# EAGLE design IR Interface Board (EAGLE 7.6.0)

## Sheet 1 of 3
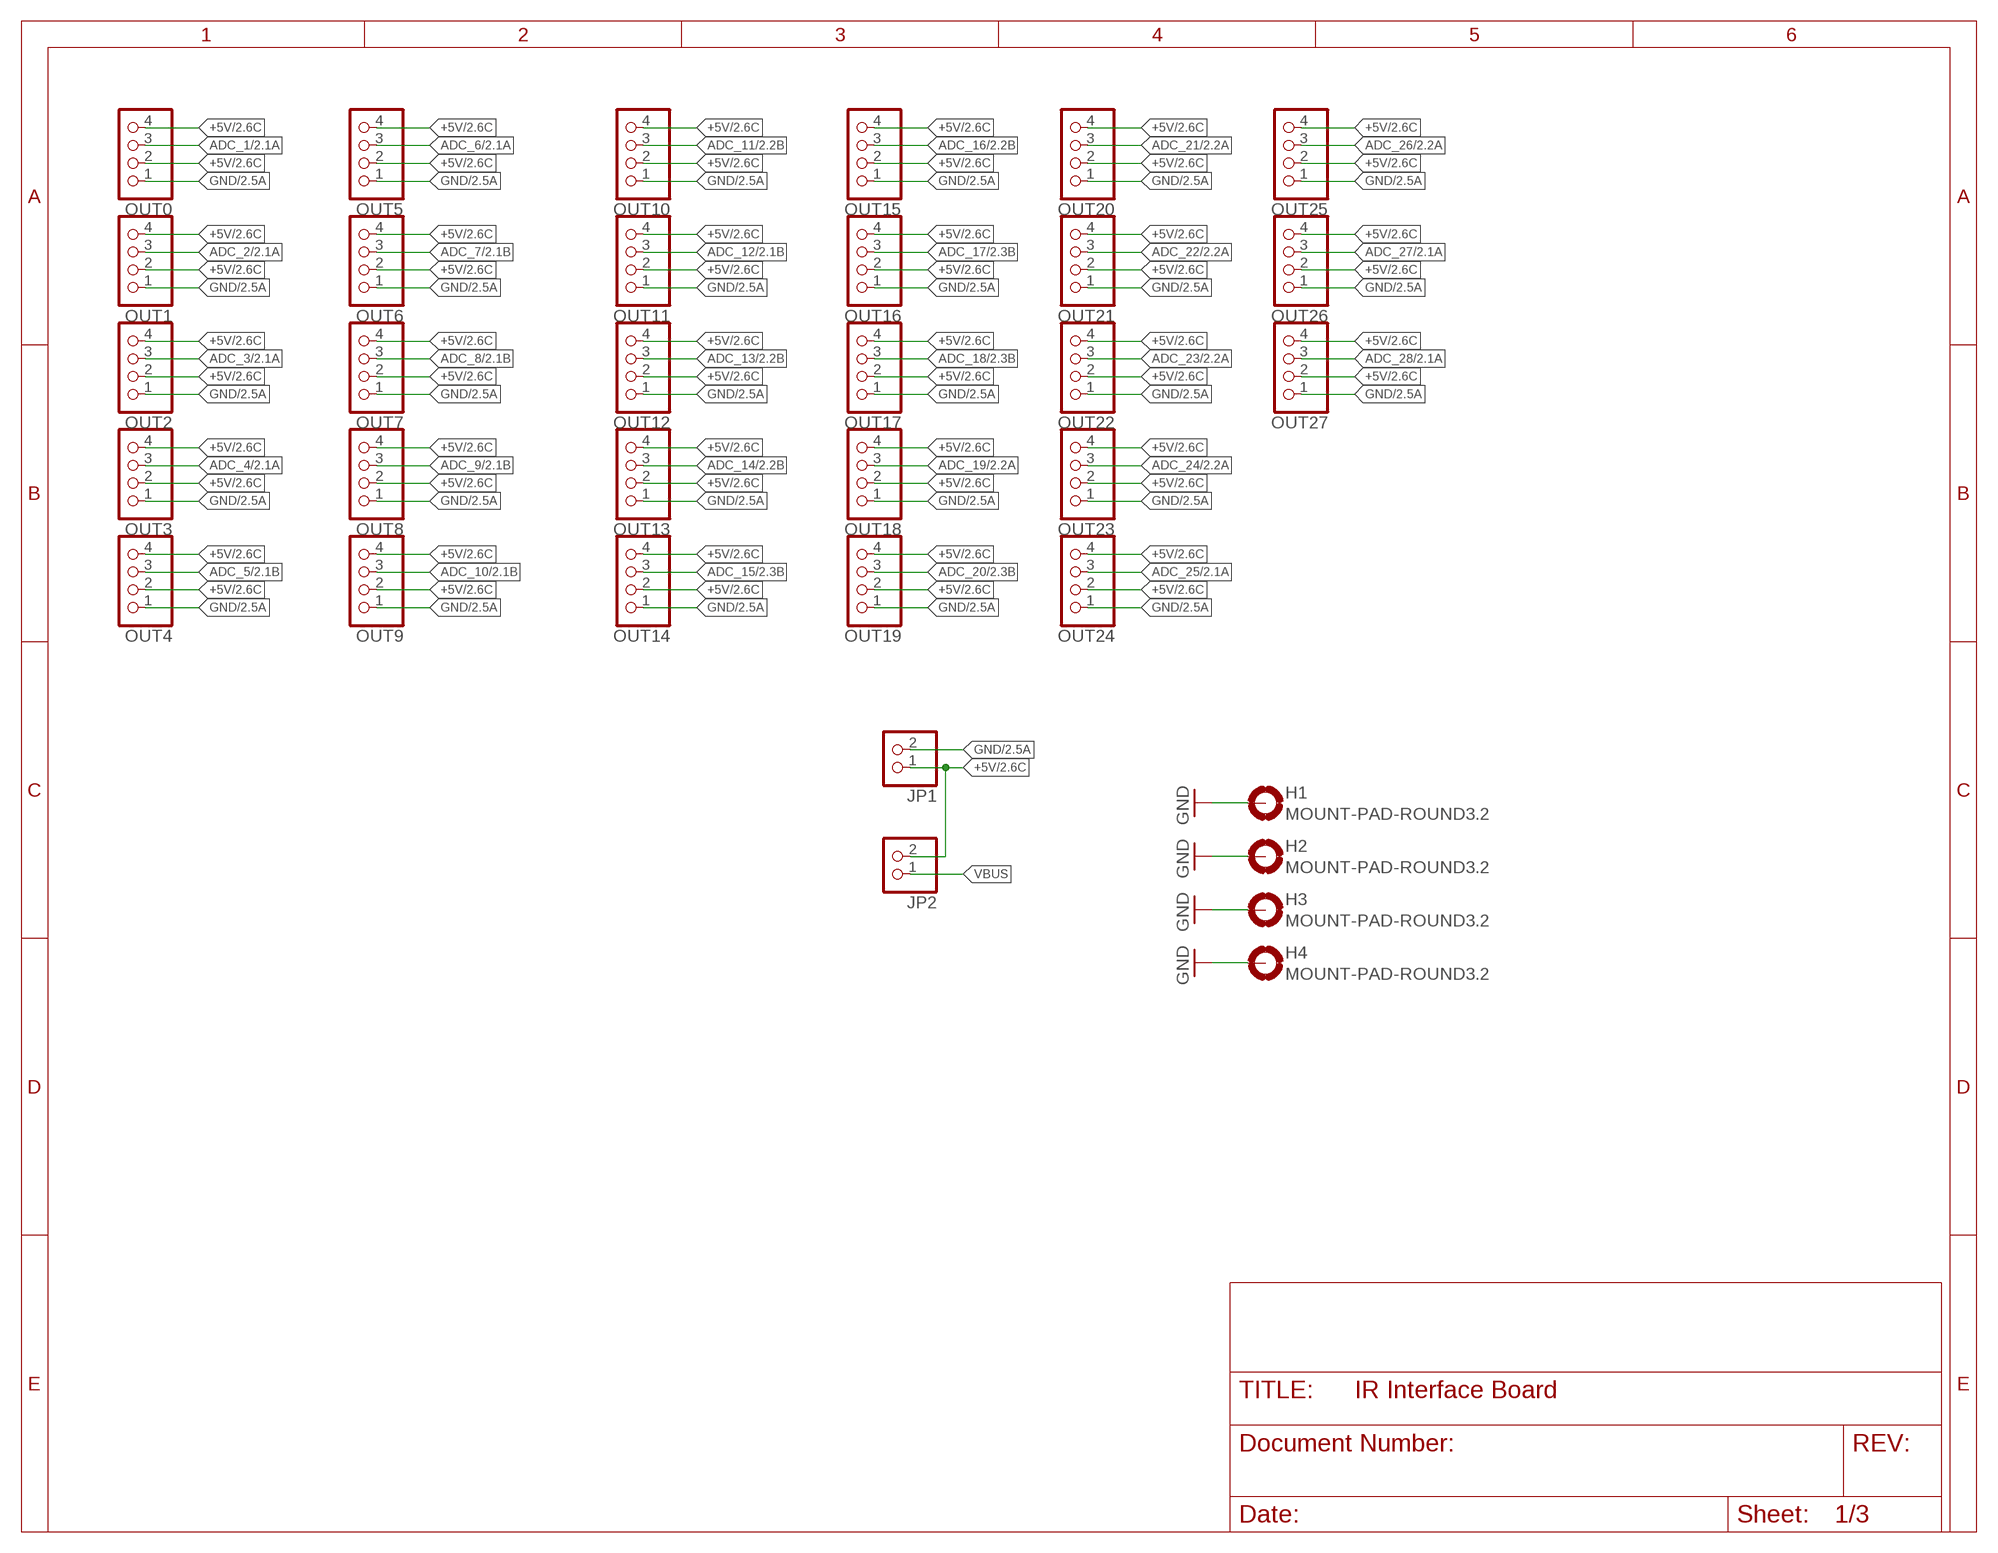
[diagram p0: schematic, sheet 1]

### Parts
H1  MOUNT-PAD-ROUND3.2  [3,2-PAD]
H2  MOUNT-PAD-ROUND3.2  [3,2-PAD]
H3  MOUNT-PAD-ROUND3.2  [3,2-PAD]
H4  MOUNT-PAD-ROUND3.2  [3,2-PAD]
JP1  PINHD-1X2  [1X02]
JP2  PINHD-1X2  [1X02]
OUT0  PINHD-1X4  [1X04]
OUT1  PINHD-1X4  [1X04]
OUT2  PINHD-1X4  [1X04]
OUT3  PINHD-1X4  [1X04]
OUT4  PINHD-1X4  [1X04]
OUT5  PINHD-1X4  [1X04]
OUT6  PINHD-1X4  [1X04]
OUT7  PINHD-1X4  [1X04]
OUT8  PINHD-1X4  [1X04]
OUT9  PINHD-1X4  [1X04]
OUT10  PINHD-1X4  [1X04]
OUT11  PINHD-1X4  [1X04]
OUT12  PINHD-1X4  [1X04]
OUT13  PINHD-1X4  [1X04]
OUT14  PINHD-1X4  [1X04]
OUT15  PINHD-1X4  [1X04]
OUT16  PINHD-1X4  [1X04]
OUT17  PINHD-1X4  [1X04]
OUT18  PINHD-1X4  [1X04]
OUT19  PINHD-1X4  [1X04]
OUT20  PINHD-1X4  [1X04]
OUT21  PINHD-1X4  [1X04]
OUT22  PINHD-1X4  [1X04]
OUT23  PINHD-1X4  [1X04]
OUT24  PINHD-1X4  [1X04]
OUT25  PINHD-1X4  [1X04]
OUT26  PINHD-1X4  [1X04]
OUT27  PINHD-1X4  [1X04]

### Nets
+5V: JP1.1 JP2.2 OUT0.2 OUT0.4 OUT1.2 OUT1.4 OUT2.2 OUT2.4 OUT3.2 OUT3.4 OUT4.2 OUT4.4 OUT5.2 OUT5.4 OUT6.2 OUT6.4 OUT7.2 OUT7.4 OUT8.2 OUT8.4 OUT9.2 OUT9.4 OUT10.2 OUT10.4 OUT11.2 OUT11.4 OUT12.2 OUT12.4 OUT13.2 OUT13.4 OUT14.2 OUT14.4 OUT15.2 OUT15.4 OUT16.2 OUT16.4 OUT17.2 OUT17.4 OUT18.2 OUT18.4 OUT19.2 OUT19.4 OUT20.2 OUT20.4 OUT21.2 OUT21.4 OUT22.2 OUT22.4 OUT23.2 OUT23.4 OUT24.2 OUT24.4 OUT25.2 OUT25.4 OUT26.2 OUT26.4 OUT27.2 OUT27.4 ; also sheet 2
ADC_1: OUT0.3 ; also sheet 2
ADC_2: OUT1.3 ; also sheet 2
ADC_3: OUT2.3 ; also sheet 2
ADC_4: OUT3.3 ; also sheet 2
ADC_5: OUT4.3 ; also sheet 2
ADC_6: OUT5.3 ; also sheet 2
ADC_7: OUT6.3 ; also sheet 2
ADC_8: OUT7.3 ; also sheet 2
ADC_9: OUT8.3 ; also sheet 2
ADC_10: OUT9.3 ; also sheet 2
ADC_11: OUT10.3 ; also sheet 2
ADC_12: OUT11.3 ; also sheet 2
ADC_13: OUT12.3 ; also sheet 2
ADC_14: OUT13.3 ; also sheet 2
ADC_15: OUT14.3 ; also sheet 2
ADC_16: OUT15.3 ; also sheet 2
ADC_17: OUT16.3 ; also sheet 2
ADC_18: OUT17.3 ; also sheet 2
ADC_19: OUT18.3 ; also sheet 2
ADC_20: OUT19.3 ; also sheet 2
ADC_21: OUT20.3 ; also sheet 2
ADC_22: OUT21.3 ; also sheet 2
ADC_23: OUT22.3 ; also sheet 2
ADC_24: OUT23.3 ; also sheet 2
ADC_25: OUT24.3 ; also sheet 2
ADC_26: OUT25.3 ; also sheet 2
ADC_27: OUT26.3 ; also sheet 2
ADC_28: OUT27.3 ; also sheet 2
GND: H1.B3,2(MOUNT) H2.B3,2(MOUNT) H3.B3,2(MOUNT) H4.B3,2(MOUNT) JP1.2 OUT0.1 OUT1.1 OUT2.1 OUT3.1 OUT4.1 OUT5.1 OUT6.1 OUT7.1 OUT8.1 OUT9.1 OUT10.1 OUT11.1 OUT12.1 OUT13.1 OUT14.1 OUT15.1 OUT16.1 OUT17.1 OUT18.1 OUT19.1 OUT20.1 OUT21.1 OUT22.1 OUT23.1 OUT24.1 OUT25.1 OUT26.1 OUT27.1 ; also sheet 2
VBUS: JP2.1 ; also sheet 2

## Sheet 2 of 3
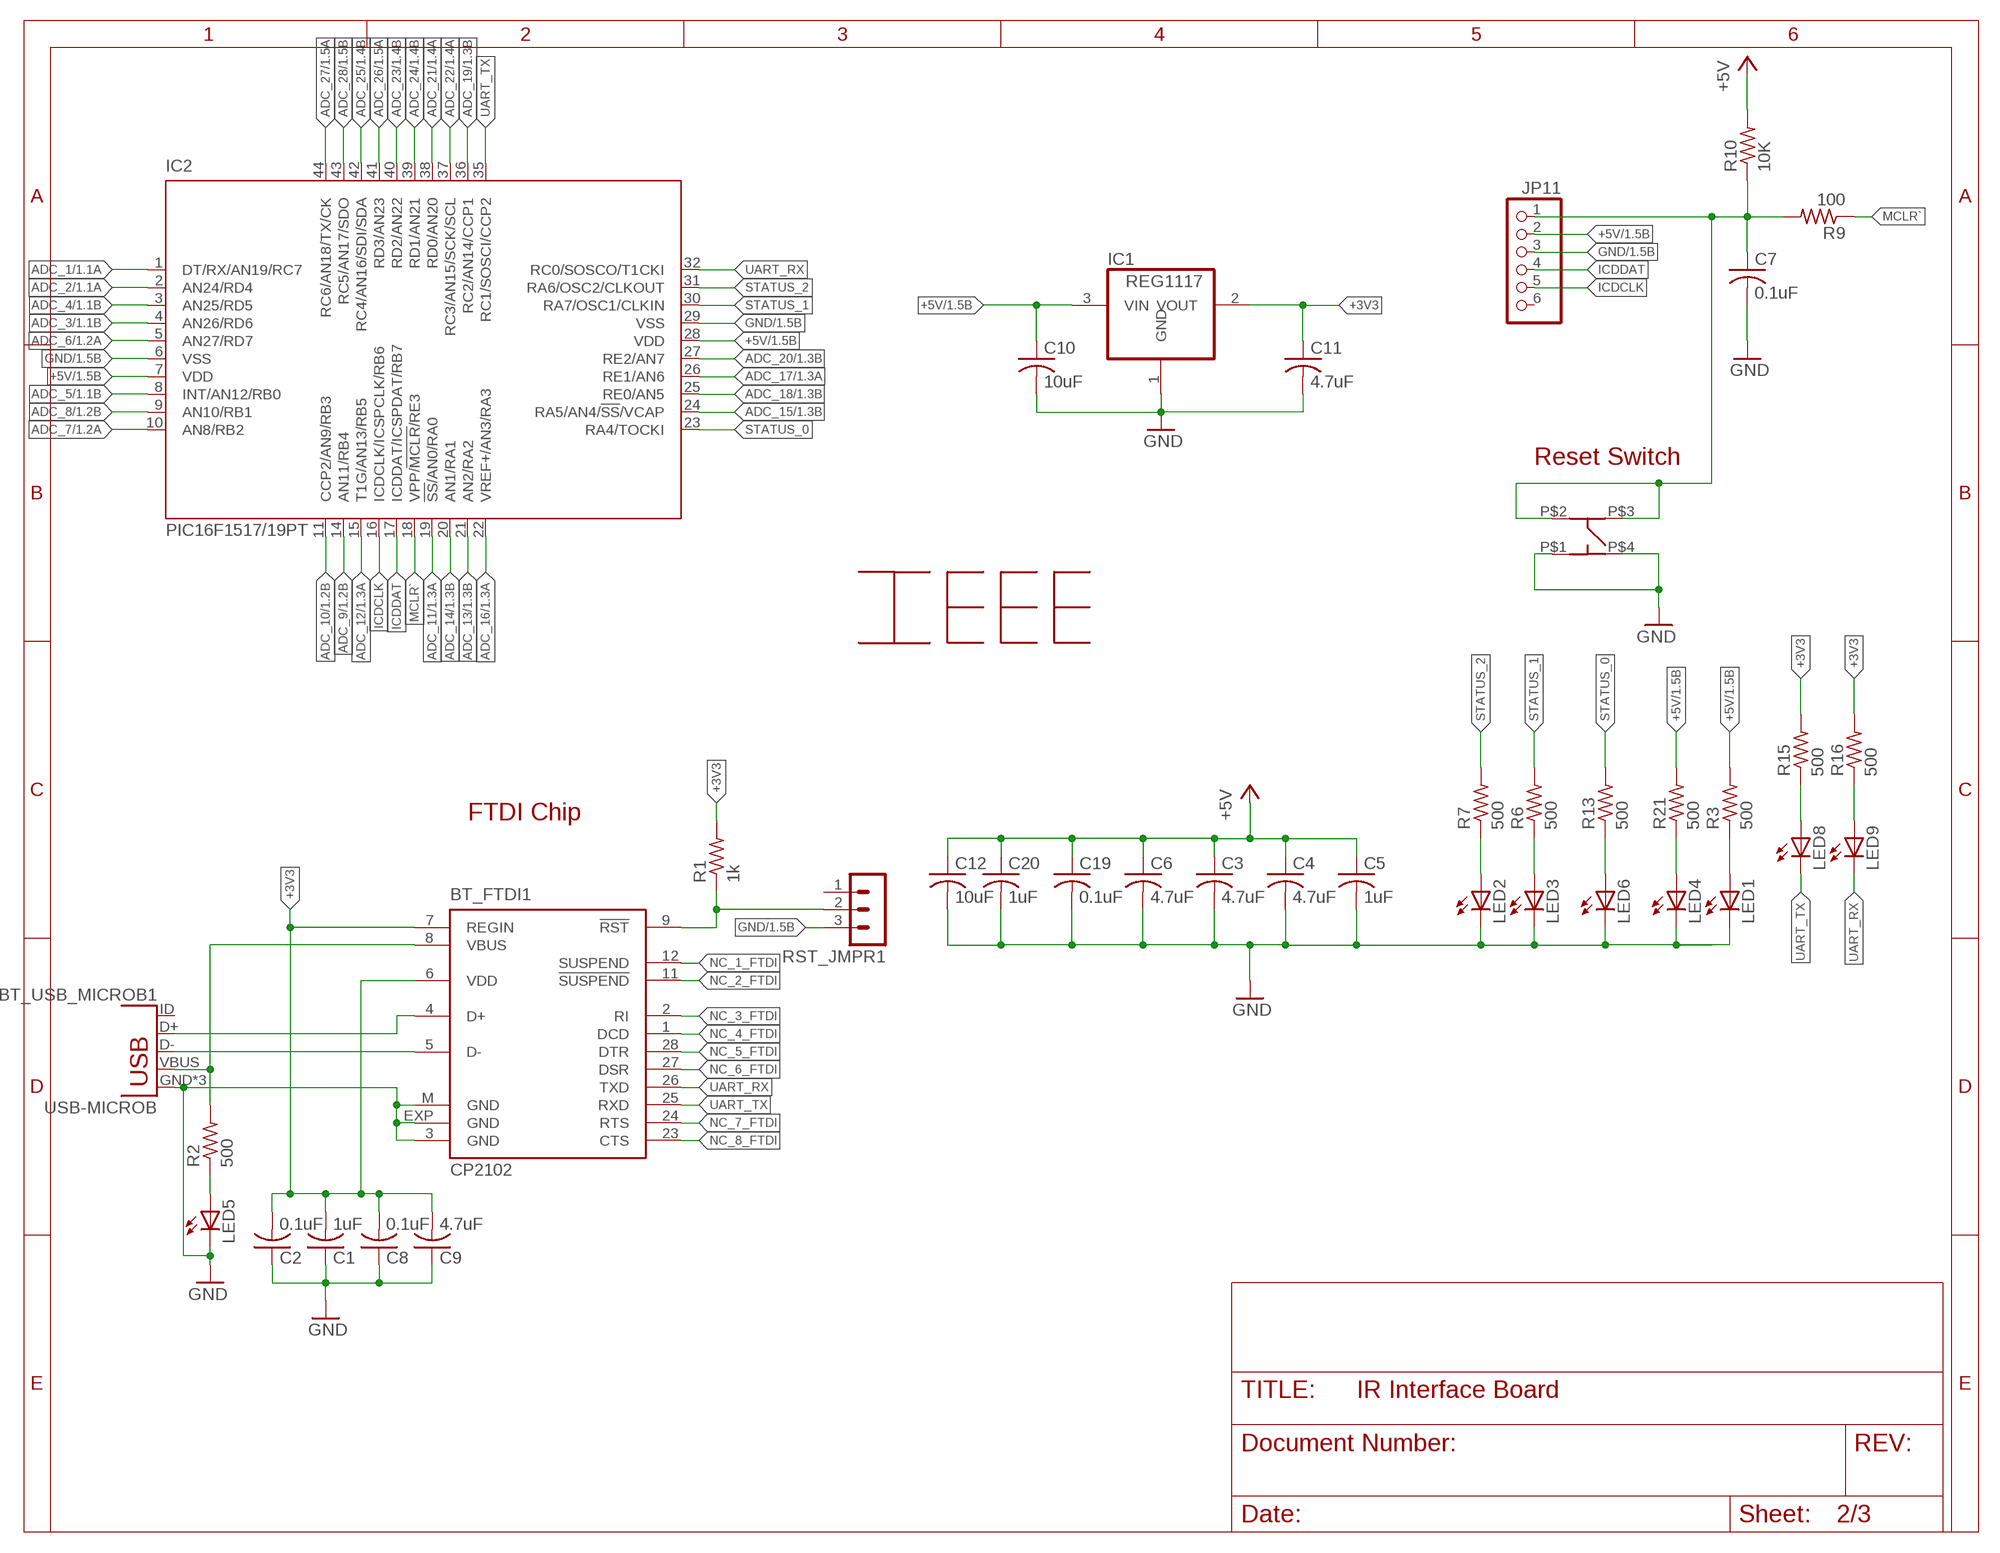
[diagram p1: schematic, sheet 2]

### Parts
BT_FTDI1  CP2102  [MLP28]
BT_USB_MICROB1  USB-MICROB  [USB-MICROB]
C1  1uF  C-USC0805  [C0805]
C2  0.1uF  C-USC0805  [C0805]
C3  4.7uF  C-USC0805  [C0805]
C4  4.7uF  C-USC0805  [C0805]
C5  1uF  C-USC0805  [C0805]
C6  4.7uF  C-USC0805  [C0805]
C7  0.1uF  C-USC0805  [C0805]
C8  0.1uF  C-USC0805  [C0805]
C9  4.7uF  C-USC0805  [C0805]
C10  10uF  C-USC0805  [C0805]
C11  4.7uF  C-USC0805  [C0805]
C12  10uF  C-USC0805  [C0805]
C19  0.1uF  C-USC0805  [C0805]
C20  1uF  C-USC0805  [C0805]
IC1  REG1117  [SOT223]
IC2  PIC16F1517/19PT  [TQFP44]
JP11  PINHD-1X6/90  [1X06/90]
LED1  LEDSML0603  [SML0603]
LED2  LEDSML0603  [SML0603]
LED3  LEDSML0603  [SML0603]
LED4  LEDSML0603  [SML0603]
LED5  LEDSML0603  [SML0603]
LED6  LEDSML0603  [SML0603]
LED8  LEDSML0603  [SML0603]
LED9  LEDSML0603  [SML0603]
R1  1k  R-US_R0805  [R0805]
R2  500  R-US_R0805  [R0805]
R3  500  R-US_R0805  [R0805]
R6  500  R-US_R0805  [R0805]
R7  500  R-US_R0805  [R0805]
R9  100  R-US_R0805  [R0805]
R10  10K  R-US_R0805  [R0805]
R13  500  R-US_R0805  [R0805]
R15  500  R-US_R0805  [R0805]
R16  500  R-US_R0805  [R0805]
R21  500  R-US_R0805  [R0805]
RST_JMPR1  MA03-1  [MA03-1]
TOUCH_RESET  RESET  MC32882_SW  [MC32882_FINAL]
U$1  LOGO  [IEEE-LOGO]

### Nets
+3V3: BT_FTDI1.6(VDD) BT_FTDI1.7(REGIN) C1.2 C2.2 C8.2 C9.2 C11.1 IC1.2(VOUT) R1.2 R15.2 R16.2
+5V: C3.1 C4.1 C5.1 C6.1 C10.1 C12.1 C19.1 C20.1 IC1.3(VIN) IC2.7(VDD) IC2.28(VDD) JP11.2 R3.2 R10.2 R21.2 ; also sheet 1
ADC_1: IC2.1(DT/RX/AN19/RC7) ; also sheet 1
ADC_2: IC2.2(AN24/RD4) ; also sheet 1
ADC_3: IC2.4(AN26/RD6) ; also sheet 1
ADC_4: IC2.3(AN25/RD5) ; also sheet 1
ADC_5: IC2.8(INT/AN12/RB0) ; also sheet 1
ADC_6: IC2.5(AN27/RD7) ; also sheet 1
ADC_7: IC2.10(AN8/RB2) ; also sheet 1
ADC_8: IC2.9(AN10/RB1) ; also sheet 1
ADC_9: IC2.14(AN11/RB4) ; also sheet 1
ADC_10: IC2.11(CCP2/AN9/RB3) ; also sheet 1
ADC_11: IC2.19(!SS!/AN0/RA0) ; also sheet 1
ADC_12: IC2.15(T1G/AN13/RB5) ; also sheet 1
ADC_13: IC2.21(AN2/RA2) ; also sheet 1
ADC_14: IC2.20(AN1/RA1) ; also sheet 1
ADC_15: IC2.24(RA5/AN4/!SS!/VCAP) ; also sheet 1
ADC_16: IC2.22(VREF+/AN3/RA3) ; also sheet 1
ADC_17: IC2.26(RE1/AN6) ; also sheet 1
ADC_18: IC2.25(RE0/AN5) ; also sheet 1
ADC_19: IC2.36(RC2/AN14/CCP1) ; also sheet 1
ADC_20: IC2.27(RE2/AN7) ; also sheet 1
ADC_21: IC2.38(RD0/AN20) ; also sheet 1
ADC_22: IC2.37(RC3/AN15/SCK/SCL) ; also sheet 1
ADC_23: IC2.40(RD2/AN22) ; also sheet 1
ADC_24: IC2.39(RD1/AN21) ; also sheet 1
ADC_25: IC2.42(RC4/AN16/SDI/SDA) ; also sheet 1
ADC_26: IC2.41(RD3/AN23) ; also sheet 1
ADC_27: IC2.44(RC6/AN18/TX/CK) ; also sheet 1
ADC_28: IC2.43(RC5/AN17/SDO) ; also sheet 1
BT_D+1: BT_FTDI1.4(D+) BT_USB_MICROB1.D+
BT_D-1: BT_FTDI1.5(D-) BT_USB_MICROB1.D-
GND: BT_FTDI1.3(GND) BT_FTDI1.EXP(GND) BT_FTDI1.M(GND) BT_USB_MICROB1.GND BT_USB_MICROB1.MT1(GND) BT_USB_MICROB1.MT2(GND) C1.1 C2.1 C3.2 C4.2 C5.2 C6.2 C7.2 C8.1 C9.1 C10.2 C11.2 C12.2 C19.2 C20.2 IC1.1(GND) IC2.6(VSS) IC2.29(VSS) JP11.3 LED1.C LED2.C LED3.C LED4.C LED5.C LED6.C RST_JMPR1.3 TOUCH_RESET.P$1(P1) TOUCH_RESET.P$4(P4) ; also sheet 1
ICDCLK: IC2.16(ICDCLK/ICSPCLK/RB6) JP11.5
ICDDAT: IC2.17(ICDDAT/ICSPDAT/RB7) JP11.4
MCLR: C7.1 JP11.1 R9.2 R10.1 TOUCH_RESET.P$2(P2) TOUCH_RESET.P$3(P3)
MCLR`: IC2.18(VPP/!MCLR!/RE3) R9.1
N$1: LED3.A R6.1
N$2: BT_FTDI1.9(!RST) R1.1 RST_JMPR1.2
N$3: LED6.A R13.1
N$4: LED1.A R3.1
N$6: LED2.A R7.1
N$8: LED4.A R21.1
N$10: LED8.A R15.1
N$11: LED9.A R16.1
N$12: LED5.A R2.1
NC_1_FTDI: BT_FTDI1.12(SUSPEND)
NC_2_FTDI: BT_FTDI1.11(!SUSPEND)
NC_3_FTDI: BT_FTDI1.2(RI)
NC_4_FTDI: BT_FTDI1.1(DCD)
NC_5_FTDI: BT_FTDI1.28(DTR)
NC_6_FTDI: BT_FTDI1.27(DSR)
NC_7_FTDI: BT_FTDI1.24(RTS)
NC_8_FTDI: BT_FTDI1.23(CTS)
STATUS_0: IC2.23(RA4/TOCKI) R13.2
STATUS_1: IC2.30(RA7/OSC1/CLKIN) R6.2
STATUS_2: IC2.31(RA6/OSC2/CLKOUT) R7.2
UART_RX: BT_FTDI1.26(TXD) IC2.32(RC0/SOSCO/T1CKI) LED9.C
UART_TX: BT_FTDI1.25(RXD) IC2.35(RC1/SOSCI/CCP2) LED8.C
VBUS: BT_FTDI1.8(VBUS) BT_USB_MICROB1.VBUS R2.2 ; also sheet 1
Unconnected: BT_USB_MICROB1.ID JP11.6 RST_JMPR1.1

### Notes on the sheet
- Reset Switch
- FTDI Chip

## Sheet 3 of 3
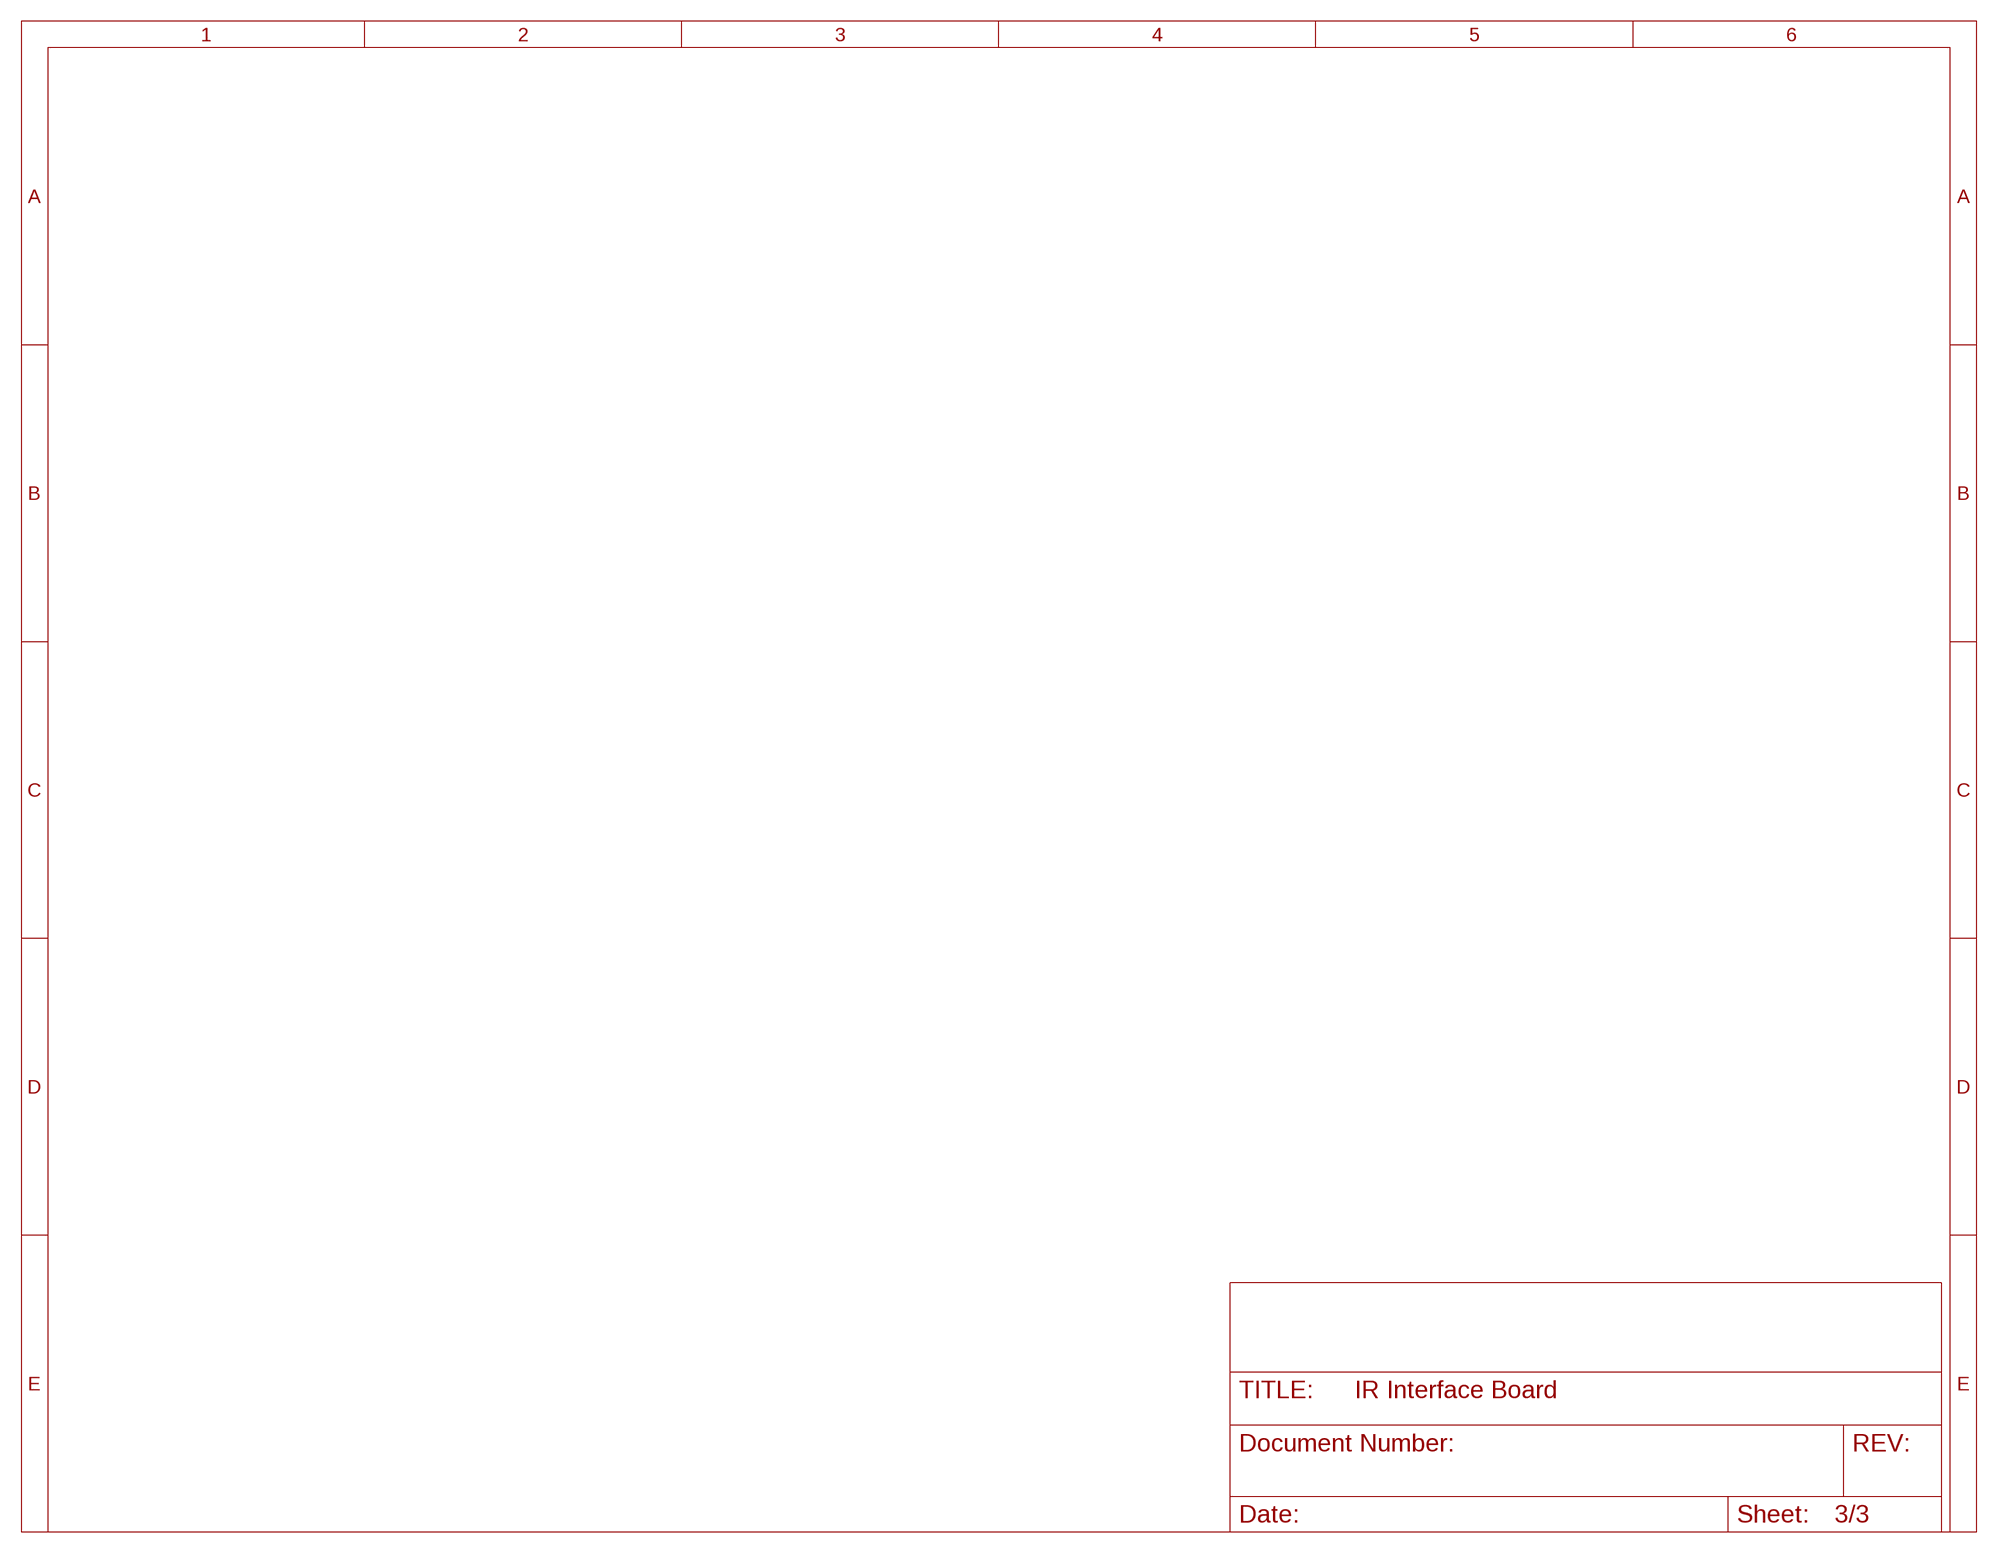
[diagram p2: schematic, sheet 3]

## Library data of the parts
BT_FTDI1 = silabs:CP210*: Single-Chip USB to UART Bridge Source: www.silabs.com .. CP2101.pdf / cp2102.pdf; MF: FARNELL; MPN: CP2102-GM; OC_FARNELL: 9282130; OC_NEWARK: 30K5635
BT_USB_MICROB1 = Mother-Board-rev5:USB: USB Connectors USB-B-PTH is fully proven SKU : PRT-00139/CONN-08278 USB-miniB is fully proven SKU : PRT-00587 USB-A-PCB is untested. USB-A-H is throughly reviewed, but untested. Spark Fun Electronics SKU : PRT-00437 USB-B-SMT is throughly reviewed, but untested. Needs silkscreen touching up. USB-A-S has not been used/tested USB-MB-H has not been used/tested USB-MICROB has been used. CONN-09505; PROD_ID: CONN-09505
C1-C12 C19 C20 = rcl:C-US: CAPACITOR, American symbol
H1-H4 = holes:MOUNT-PAD-ROUND: MOUNTING PAD, round
IC1 = burr-brown:REG1117: 800mA and 1A Low Dropout (LDO) Positive Regulator 1.8V, 2.5V, 2.85V, 3.3V, 5V, and Adj; MPN: REG1117; OC_FARNELL: 1097566; OC_NEWARK: 14P6981
IC2 = microchip:PIC16*F1517/19: 28/40/44-Pin Flash Microcontrollers with nanoWatt XLP Technology PIC16F1517/1519 AND PIC16LF1517/1519 Source: www.microchip.com PIC16F1516.pdf
JP1 JP2 = pinhead:PINHD-1X2: PIN HEADER
JP11 = pinhead:PINHD-1X6: PIN HEADER
LED1-LED6 LED8 LED9 = interface_board-rev13:LED: LED OSRAM: - CHIPLED LG R971, LG N971, LY N971, LG Q971, LY Q971, LO R971, LY R971 LH N974, LH R974 LS Q976, LO Q976, LY Q976 LO Q996 - Hyper CHIPLED LW Q18S LB Q993, LB Q99A, LB R99A - SideLED LS A670, LO A670, LY A670, LG A670, LP A670 LB A673, LV A673, LT A673, LW A673 LH A674 LY A675 LS A676, LA A676, LO A676, LY A676, LW A676 LS A679, LY A679, LG A679 - Hyper Micro SIDELED® LS Y876, LA Y876, LO Y876, LY Y876 LT Y87S - SmartLED LW L88C, LW L88S LB L89C, LB L89S, LG L890 LS L89K, LO L89K, LY L89K LS L896, LA L896, LO L896, LY L896 - TOPLED LS T670, LO T670, LY T670, LG T670, LP T670 LSG T670, LSP T670, LSY T670, LOP T670, LYG T670 LG T671, LOG T671, LSG T671 LB T673, LV T673, LT T673, LW T673 LH T674 LS T676, LA T676, LO T676, LY T676, LB T676, LH T676, LSB T676, LW T676 LB T67C, LV T67C, LT T67C, LS T67K, LO T67K, LY T67K, LW E67C LS E67B, LA E67B, LO E67B, LY E67B, LB E67C, LV E67C, LT E67C LW T67C LS T679, LY T679, LG T679 LS T770, LO T770, LY T770, LG T770, LP T770 LB T773, LV T773, LT T773, LW T773 LH T774 LS E675, LA E675, LY E675, LS T675 LS T776, LA T776, LO T776, LY T776, LB T776 LHGB T686 LT T68C, LB T68C - Hyper Mini TOPLED® LB M676 - Mini TOPLED Santana® LG M470 LS M47K, LO M47K, LY M47K Source: http://www.osram.convergy.de LUXEON: - LUMILED® LXK2-PW12-R00, LXK2-PW12-S00, LXK2-PW14-U00, LXK2-PW14-V00 LXK2-PM12-R00, LXK2-PM12-S00, LXK2-PM14-U00 LXK2-PE12-Q00, LXK2-PE12-R00, LXK2-PE12-S00, LXK2-PE14-T00, LXK2-PE14-U00 LXK2-PB12-K00, LXK2-PB12-L00, LXK2-PB12-M00, LXK2-PB14-N00, LXK2-PB14-P00, LXK2-PB14-Q00 LXK2-PR12-L00, LXK2-PR12-M00, LXK2-PR14-Q00, LXK2-PR14-R00 LXK2-PD12-Q00, LXK2-PD12-R00, LXK2-PD12-S00 LXK2-PH12-R00, LXK2-PH12-S00 LXK2-PL12-P00, LXK2-PL12-Q00, LXK2-PL12-R00 Source: www.luxeon.com KINGBRIGHT: KA-3528ASYC Source: www.kingbright.com
OUT0 OUT1-OUT27 = pinhead:PINHD-1X4: PIN HEADER
R1 = resistor:R-US_: RESISTOR, American symbol
R2 R3 R6 R7 R9 R10 R13 R15 R16 R21 = rcl:R-US_: RESISTOR, American symbol
RST_JMPR1 = con-lstb:MA03-1: PIN HEADER; OC_FARNELL: unknown; OC_NEWARK: unknown
TOUCH_RESET = power_lib:MC32882_SW
U$1 = IEEE-logo:LOGO

## Board
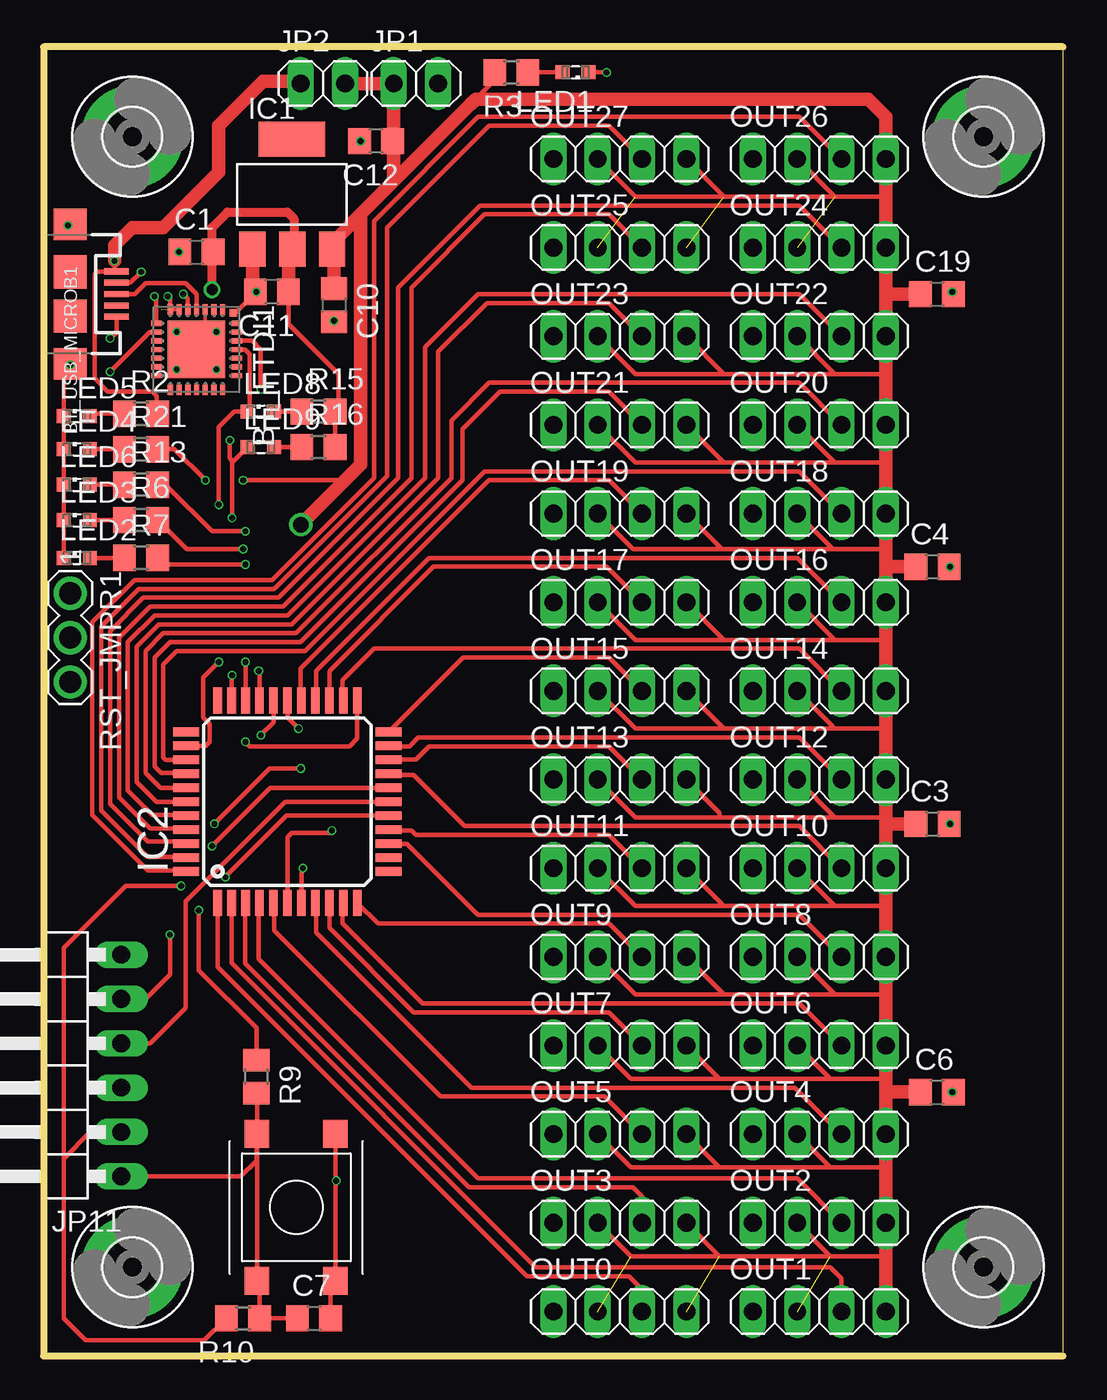
[diagram p3: board, top side]
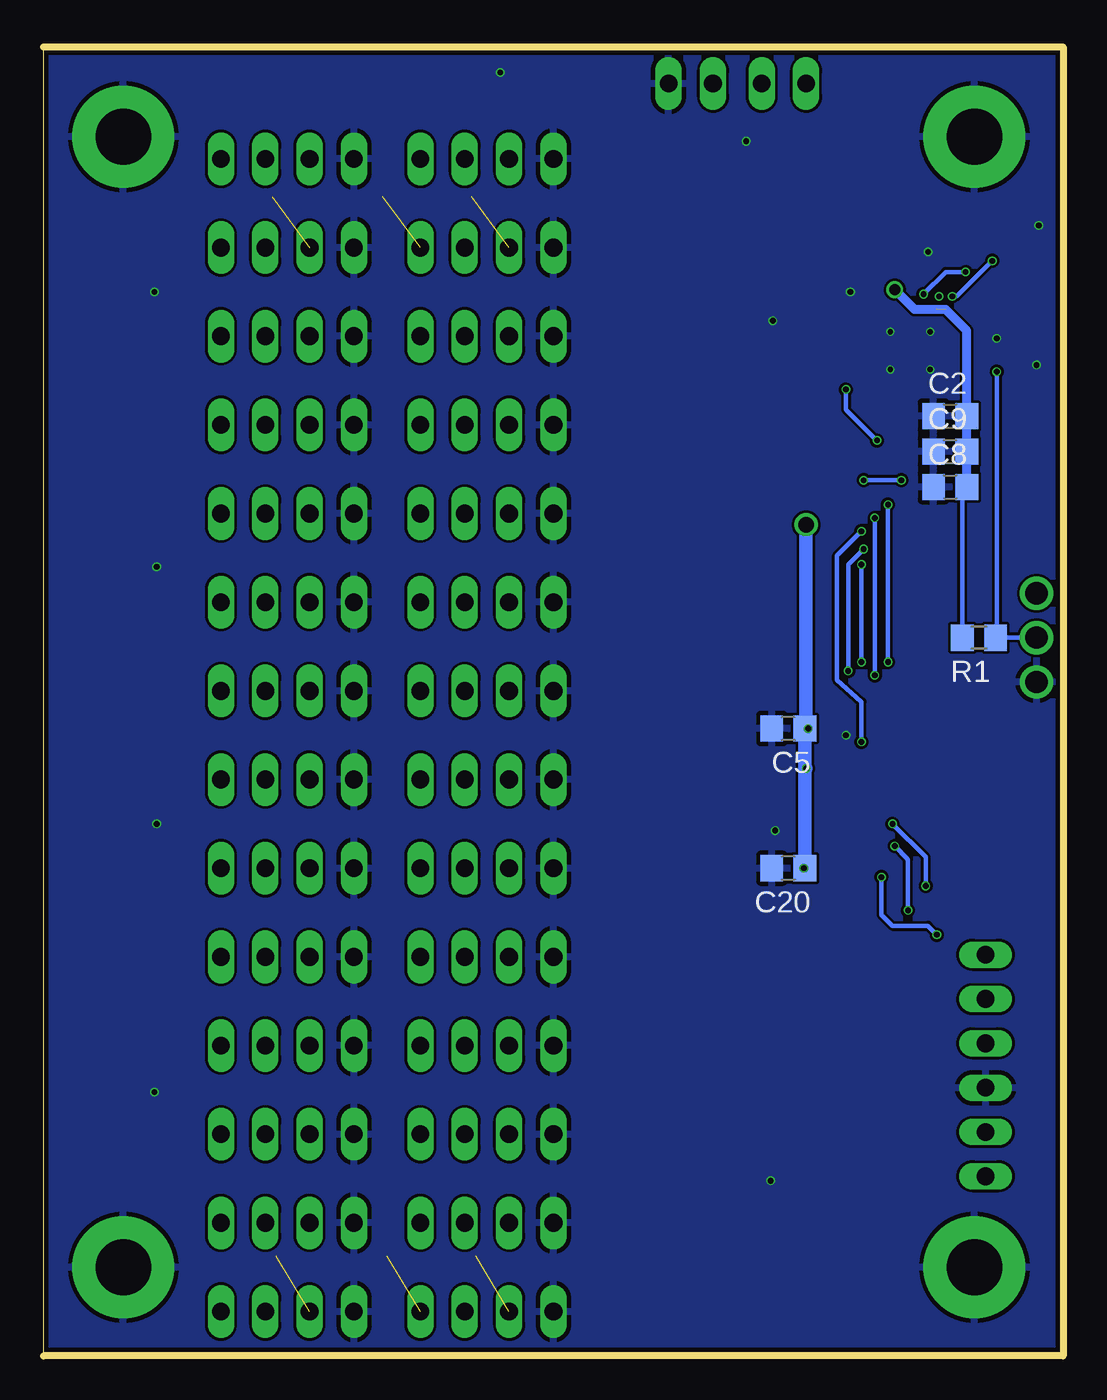
[diagram p4: board, bottom side, seen from below]

Size 58.42 x 75 mm. Coordinates in mm from the lower left corner, seen from the top.
Outline: 0,0 58.42,0 58.42,75 0,75 0,0
Copper layers (1*16): Top 0.035mm / dielectric 1.5mm / Bottom 0.035mm
Design rules "EagleRules-2-Layer-Shep": minimum track width 6mil, minimum drill 12mil, track to track 6mil, track to pad 6mil, pad to pad 6mil, via to via 6mil, smd to smd 0mil, copper to edge 10mil, drill to drill 10mil, minimum pad ring 2mil, minimum via ring 2mil, stop-mask expansion 2mil, vias tented up to drill 100mil, thermal gap 10mil

### Footprints (pad centres in the part's own frame; a part is rotated, then mirrored left to right if it is on the bottom)
MLP28 = smd 0.6 x 0.3: 1 -2.3,1.5; 2 -2.3,1; 3 -2.3,0.5; 4 -2.3,0; 5 -2.3,-0.5; 6 -2.3,-1; 7 -2.3,-1.5; 15 2.3,-1.5; 16 2.3,-1; 17 2.3,-0.5; 18 2.3,0; 19 2.3,0.5; 20 2.3,1; 21 2.3,1.5 | smd 0.3 x 0.6: 8 -1.5,-2.3; 9 -1,-2.3; 10 -0.5,-2.3; 11 0,-2.3; 12 0.5,-2.3; 13 1,-2.3; 14 1.5,-2.3; 22 1.5,2.3; 23 1,2.3; 24 0.5,2.3; 25 0,2.3; 26 -0.5,2.3; 27 -1,2.3; 28 -1.5,2.3 | smd 3.3 x 3.3: EXP 0,0 | smd 0.435 x 0.435: M -2.103,2.103
USB-MICROB = smd 0.35 x 1.4: D+ 0,2.65; D- -0.65,2.65; GND 1.3,2.65; ID 0.65,2.65; VBUS -1.3,2.65 | smd 1.8 x 1.9: MT1 -4,0; MT2 4,0 | smd 1.9 x 1.9: P$1 -1.27,0; P$2 1.27,0
C0805 = smd 1.3 x 1.5: 1 -0.95,0; 2 0.95,0
3,2-PAD = drill 3.2 pad 5.842: B3,2 0,0
SOT223 = smd 1.499 x 2.007: 1 -2.261,-3.15; 2 0.025,-3.15; 3 2.311,-3.15 | smd 3.81 x 2.007: 4 0,3.15
TQFP44 = smd 1.5 x 0.5: 1 -5.8,4; 2 -5.8,3.2; 3 -5.8,2.4; 4 -5.8,1.6; 5 -5.8,0.8; 6 -5.8,0; 7 -5.8,-0.8; 8 -5.8,-1.6; 9 -5.8,-2.4; 10 -5.8,-3.2; 11 -5.8,-4; 23 5.8,-4; 24 5.8,-3.2; 25 5.8,-2.4; 26 5.8,-1.6; 27 5.8,-0.8; 28 5.8,0; 29 5.8,0.8; 30 5.8,1.6; 31 5.8,2.4; 32 5.8,3.2; 33 5.8,4 | smd 0.5 x 1.5: 12 -4,-5.8; 13 -3.2,-5.8; 14 -2.4,-5.8; 15 -1.6,-5.8; 16 -0.8,-5.8; 17 0,-5.8; 18 0.8,-5.8; 19 1.6,-5.8; 20 2.4,-5.8; 21 3.2,-5.8; 22 4,-5.8; 34 4,5.8; 35 3.2,5.8; 36 2.4,5.8; 37 1.6,5.8; 38 0.8,5.8; 39 0,5.8; 40 -0.8,5.8; 41 -1.6,5.8; 42 -2.4,5.8; 43 -3.2,5.8; 44 -4,5.8
1X02 = drill 1.016 long: 1 -1.27,0; 2 1.27,0
1X06/90 = drill 1.016 long: 1 -6.35,-3.81; 2 -3.81,-3.81; 3 -1.27,-3.81; 4 1.27,-3.81; 5 3.81,-3.81; 6 6.35,-3.81
SML0603 = smd 0.8 x 0.8: A 0.75,0; C -0.75,0
1X04 = drill 1.016 long: 1 -3.81,0; 2 -1.27,0; 3 1.27,0; 4 3.81,0
R0805 = smd 1.3 x 1.5: 1 -0.95,0; 2 0.95,0
MA03-1 = drill 1.27: 1 -2.54,0; 2 0,0; 3 2.54,0
MC32882_FINAL = smd 1.6 x 1.4: P$1 -4.2,-2.25; P$2 -4.2,2.25; P$3 4.2,2.25; P$4 4.2,-2.25

### Placement (x,y rotation side)
BT_FTDI1  8.76,57.66 270 top
BT_USB_MICROB1  1.52,60.83 270 top
C1  8.76,63.25 0 top
C2  6.48,53.85 0 bottom
C3  50.93,30.48 0 top
C4  50.93,45.21 0 top
C5  15.75,35.94 180 bottom
C6  51.18,15.11 0 top
C7  15.49,2.16 0 top
C8  6.48,49.78 0 bottom
C9  6.48,51.82 0 bottom
C10  16.64,60.2 270 top
C11  13.08,60.96 180 top
C12  19.05,69.6 180 top
C19  51.18,60.83 0 top
C20  15.75,27.94 180 bottom
H1  53.85,69.85 0 top
H2  53.85,5.08 0 top
H3  5.08,5.08 0 top
H4  5.08,69.85 0 top
IC1  14.22,66.55 0 top
IC2  13.97,31.75 90 top
JP1  21.34,72.9 0 top
JP2  16,72.9 0 top
JP11  0.64,16.64 90 top
LED1  30.48,73.53 180 top
LED2  1.91,45.72 0 top
LED3  1.91,47.88 0 top
LED4  1.91,51.94 0 top
LED5  1.91,53.85 0 top
LED6  1.91,49.91 0 top
LED8  12.45,54.1 0 top
LED9  12.45,52.07 0 top
OUT0  33.02,2.54 0 top
OUT1  44.45,2.54 0 top
OUT2  44.45,7.62 0 top
OUT3  33.02,7.62 0 top
OUT4  44.45,12.7 0 top
OUT5  33.02,12.7 0 top
OUT6  44.45,17.78 0 top
OUT7  33.02,17.78 0 top
OUT8  44.45,22.86 0 top
OUT9  33.02,22.86 0 top
OUT10  44.45,27.94 0 top
OUT11  33.02,27.94 0 top
OUT12  44.45,33.02 0 top
OUT13  33.02,33.02 0 top
OUT14  44.45,38.1 0 top
OUT15  33.02,38.1 0 top
OUT16  44.45,43.18 0 top
OUT17  33.02,43.18 0 top
OUT18  44.45,48.26 0 top
OUT19  33.02,48.26 0 top
OUT20  44.45,53.34 0 top
OUT21  33.02,53.34 0 top
OUT22  44.45,58.42 0 top
OUT23  33.02,58.42 0 top
OUT24  44.45,63.5 0 top
OUT25  33.02,63.5 0 top
OUT26  44.45,68.58 0 top
OUT27  33.02,68.58 0 top
R1  4.83,41.15 180 bottom
R2  5.59,53.98 0 top
R3  26.8,73.53 180 top
R6  5.59,47.88 0 top
R7  5.59,45.72 0 top
R9  12.19,16 270 top
R10  11.43,2.16 180 top
R13  5.59,49.91 0 top
R15  15.75,54.1 0 top
R16  15.75,52.07 0 top
R21  5.59,51.94 0 top
RST_JMPR1  1.52,41.15 270 top
TOUCH_RESET  14.48,8.51 90 top

### Tracks (layer width: path | path; a pad name or v marks a point on that pad's centre or on a via)
+3V3  (via drill 0.33, 0.64)  (1 unrouted)
  Top 0.254: R16.2 R15.2 16.89,54.3 16.89,56.26 14.03,59.12 C11.1 | BT_FTDI1.6 BT_FTDI1.7 7.26,60.55 v7.11,60.71 | C1.2 9.71,63.31 9.65,63.37
  Top 0.508: v9.65,61.09 9.65,63.37 9.65,64.64 10.54,65.53 13.97,65.53 14.35,65.15 14.35,63.5 IC1.2
  Top 0.762: C11.1 14.03,63.18 IC1.2
  Bottom 0.254: R1.2 5.78,49.53 C8.2
  Bottom 0.508: C8.2 C9.2 C2.2 5.53,58.74 6.73,59.94 8.51,59.94 v9.65,61.09
+5V  (via drill 0.33, 0.89)  (6 unrouted)
  Top 0.254: OUT3.2 33.66,5.71 38.73,5.71 | 38.73,5.71 45.09,5.71 | 45.09,5.71 48.26,5.71 | OUT2.2 45.09,5.71 | OUT3.4 38.73,5.71 | OUT5.2 33.66,10.79 38.73,10.79 | 38.73,10.79 45.09,10.79 | 45.09,10.79 48.26,10.79 | OUT4.2 45.09,10.79 | OUT5.4 38.73,10.79 | OUT7.2 33.66,15.88 38.73,15.88 | 38.73,15.88 45.09,15.88 | 45.09,15.88 48.26,15.88 | OUT6.2 45.09,15.88 | OUT7.4 38.73,15.88 | OUT9.2 33.91,20.7 38.99,20.7 | 38.99,20.7 45.34,20.7 | 45.34,20.7 48.26,20.7 | OUT8.2 45.34,20.7 | OUT11.2 33.91,25.78 38.86,25.78 | 38.86,25.78 45.34,25.78 | 45.34,25.78 48.26,25.78 | OUT10.2 45.34,25.78 | OUT13.2 33.91,30.86 38.73,30.86 | 38.73,30.86 45.34,30.86 | 45.34,30.86 48.26,30.86 | OUT12.2 45.34,30.86 | OUT15.2 33.91,35.94 38.99,35.94 | 38.99,35.94 45.21,35.94 | 45.21,35.94 48.26,35.94 | OUT14.2 45.21,36.07 45.21,35.94 | OUT17.2 33.91,41.02 38.99,41.02 | 38.99,41.02 45.34,41.02 | 45.34,41.02 48.26,41.02 | OUT16.2 45.34,41.02 | OUT15.4 38.99,35.94 | OUT13.4 38.73,31.11 38.73,30.86 | OUT17.4 38.99,41.02 | OUT11.4 38.86,25.91 38.86,25.78 | OUT9.4 38.99,20.7 | OUT19.2 33.78,46.23 38.86,46.23 | 38.86,46.23 45.21,46.23 | 45.21,46.23 48.26,46.23 | OUT19.4 38.86,46.23 | OUT18.2 45.21,46.23 | OUT21.2 33.91,51.18 38.99,51.18 | 38.99,51.18 45.34,51.18 | 45.34,51.18 48.26,51.18 | OUT21.4 38.99,51.18 | OUT20.2 45.34,51.18 | OUT23.2 33.91,56.26 38.99,56.26 | 38.99,56.26 45.34,56.26 | 45.34,56.26 48.26,56.26 | OUT22.2 45.34,56.26 | OUT23.4 38.99,56.26 | OUT27.2 33.91,66.42 38.99,66.42 | 38.99,66.42 45.34,66.42 | 45.34,66.42 48.26,66.42 | OUT26.2 45.34,66.42 | OUT27.4 38.99,66.42 | 1.14,11.3 1.14,2.16 2.41,0.89 9.21,0.89 R10.2 | v14.61,35.94 13.97,36.58 IC2.28 | v14.86,27.94 14.77,27.85 IC2.7 | JP11.2 2.67,12.83 1.14,11.3
  Top 0.254: 1.14,11.3 1.14,23.37 4.7,26.92 v7.87,26.92 | v9.78,30.48 12.95,33.66 v14.73,33.66 | R21.2 7.49,51.94 v9.27,50.16 | v11.43,50.16 17.27,50.16 | R3.2 25.85,73.09 24.45,71.69
  Top 0.762: 48.26,45.47 OUT16.4 48.26,41.02 OUT14.4 48.26,35.94 OUT12.4 48.26,30.86 48.26,30.48 | 48.26,45.47 48.26,46.23 OUT18.4 48.26,51.18 OUT20.4 48.26,56.26 OUT22.4 48.26,61.09 | 48.26,30.48 OUT10.4 48.26,25.78 OUT8.4 48.26,20.7 OUT6.4 48.26,15.88 48.26,15.11 | 48.26,15.11 OUT4.4 48.26,10.79 OUT2.4 48.26,5.71 OUT1.4 | v14.73,47.62 17.27,50.16 18.16,51.05 18.16,65.41 | 18.16,65.41 20.07,67.31 | 20.07,67.31 24.45,71.69 24.77,72.01 47.24,72.01 48.26,70.99 OUT26.4 48.26,66.42 OUT24.4 48.26,61.09 | 20.07,69.6 JP1.1 JP2.2 | 20.07,69.6 20.07,67.31 | 18.16,65.41 16.89,64.14 16.89,63.75 IC1.3 16.64,63.3 C10.1 | C19.1 48.51,60.83 48.26,61.09 | C4.1 48.51,45.21 48.26,45.47 | C3.1 48.26,30.48 | C6.1 48.26,15.11 | C12.1 20.07,69.6
  Bottom 0.254: C5.1 v14.61,35.94 | C20.1 v14.86,27.94 | v7.87,26.92 7.87,28.57 v9.78,30.48 | v9.27,50.16 v11.43,50.16
  Bottom 0.762: v14.73,47.62 14.73,35.88 C5.1 14.8,33.72 v14.73,33.66 14.8,33.59 C20.1
ADC_1
  Top 0.254: OUT0.3 34.29,3.81 33.53,4.57 27.69,4.57 9.97,22.29 IC2.1
ADC_2
  Top 0.254: OUT1.3 45.72,4.45 45.09,5.08 28.19,5.08 10.77,22.5 IC2.2
ADC_3
  Top 0.254: OUT2.3 43.18,10.16 24.89,10.16 12.32,22.73 12.32,25.9 IC2.4
ADC_4
  Top 0.254: OUT3.3 34.29,9.14 33.78,9.65 24.38,9.65 11.56,22.48 11.56,25.94 IC2.3
ADC_5
  Top 0.254: OUT4.3 43.05,15.37 24.51,15.37 15.62,24.26 15.62,25.9 IC2.8
ADC_6
  Top 0.254: OUT5.3 32.13,14.86 22.73,14.86 13.21,24.38 13.21,25.91 IC2.5
ADC_7
  Top 0.254: OUT6.3 43.31,20.19 21.72,20.19 17.14,24.77 17.14,25.93 IC2.10
ADC_8
  Top 0.254: OUT7.3 32.38,19.68 21.21,19.68 16.38,24.51 16.38,25.94 IC2.9
ADC_9
  Top 0.254: OUT8.3 43.31,25.27 24.89,25.27 20.83,29.34 19.78,29.34 IC2.14
ADC_10
  Top 0.254: OUT9.3 32.38,24.77 19.16,24.77 IC2.11
ADC_11
  Top 0.254: OUT10.3 43.31,30.35 24.13,30.35 21.21,33.27 19.85,33.27 IC2.19
ADC_12
  Top 0.254: OUT11.3 32.38,29.84 21.34,29.84 21.08,30.1 19.82,30.1 IC2.15
ADC_13
  Top 0.254: OUT12.3 43.31,35.43 21.46,35.43 20.95,34.92 19.8,34.92 IC2.21
ADC_14
  Top 0.254: OUT13.3 32.38,34.92 22.1,34.92 21.34,34.16 19.78,34.16 IC2.20
ADC_15
  Top 0.254: OUT14.3 43.31,40.51 18.92,40.51 17.14,38.73 17.14,37.58 IC2.24
ADC_16
  Top 0.254: OUT15.3 32.38,40.01 24.02,40.01 IC2.22
ADC_17
  Top 0.254: OUT16.3 43.18,45.72 22.1,45.72 15.62,39.24 15.62,37.6 IC2.26
ADC_18
  Top 0.254: OUT17.3 32.26,45.21 22.35,45.21 16.38,39.24 16.38,37.56 IC2.25
ADC_19
  Top 0.254: OUT18.3 43.31,50.67 25.27,50.67 14.99,40.39 7.62,40.39 6.86,39.62 6.86,34.29 7,34.15 IC2.36 8.16,34.16
ADC_20
  Top 0.254: OUT19.3 32.38,50.16 25.53,50.16 14.73,39.37 14.73,37.59 IC2.27
ADC_21
  Top 0.254: OUT20.3 43.31,55.75 25.53,55.75 23.37,53.59 23.37,50.29 14.48,41.4 6.86,41.4 5.84,40.39 5.84,33.4 6.69,32.55 IC2.38 8.13,32.51
ADC_22
  Top 0.254: OUT21.3 32.38,55.24 26.16,55.24 24,53.09 24,50.16 14.73,40.89 7.24,40.89 6.35,40.01 6.35,33.78 6.73,33.4 8.12,33.4 IC2.37
ADC_23
  Top 0.254: OUT22.3 43.31,60.83 24.89,60.83 21.84,57.78 21.84,50.29 13.97,42.42 6.35,42.42 4.83,40.89 4.83,32.38 6.22,30.99 8.13,30.99 IC2.40
ADC_24
  Top 0.254: OUT23.3 32.38,60.33 25.4,60.33 22.61,57.53 22.61,50.29 14.22,41.91 6.6,41.91 5.33,40.64 5.33,32.89 6.48,31.75 IC2.39
ADC_25
  Top 0.254: OUT24.3 43.31,65.91 25.02,65.91 20.32,61.21 20.32,50.29 13.46,43.43 5.71,43.43 3.81,41.53 3.81,31.62 5.97,29.46 8.06,29.46 IC2.42
ADC_26
  Top 0.254: OUT25.3 32.38,65.41 25.27,65.41 21.08,61.21 21.08,50.29 13.72,42.93 6.1,42.93 4.32,41.15 4.32,32 6.1,30.23 8.09,30.23 IC2.41
ADC_27
  Top 0.254: OUT26.3 43.31,70.99 24.89,70.99 18.92,65.02 18.92,50.29 13.08,44.45 5.21,44.45 2.79,42.04 2.79,30.99 5.97,27.81 8.11,27.81 IC2.44
ADC_28
  Top 0.254: OUT27.3 32.38,70.48 25.53,70.48 19.68,64.64 19.68,50.42 13.21,43.94 5.46,43.94 3.3,41.78 3.3,31.24 5.97,28.57 8.14,28.57 IC2.43
BT_D+1
  Top 0.254: BT_FTDI1.4 8.76,60.83 8.13,61.47 5.84,61.47 5.21,60.83 BT_USB_MICROB1.D+
BT_D-1  (via drill 0.33)
  Top 0.254: BT_FTDI1.5 8.26,60.57 v8,60.83 | BT_USB_MICROB1.D- 4.97,61.48 v5.59,62.1
  Bottom 0.254: v5.59,62.1 6.73,62.1 v8,60.83
GND  (via drill 0.3, 0.33)
  Top 0.203: BT_FTDI1.3 9.26,58.29 | 9.26,58.29 8.63,58.79 BT_FTDI1.EXP | 9.26,58.29 v9.91,58.67
  Top 0.254: C7.2 16.44,4.03 TOUCH_RESET.P$1 TOUCH_RESET.P$4 16.73,10.2 v16.76,10.03 | IC2.29 13.17,36.28 v12.45,35.56 | LED2.C LED3.C LED6.C LED4.C LED5.C 1.16,56.46 BT_USB_MICROB1.MT2 v1.52,56.77 | BT_USB_MICROB1.GND 4.17,58.66 v3.81,58.29 | BT_USB_MICROB1.MT1 1.46,64.83 v1.4,64.77 | BT_FTDI1.M 10.99,59.76 v12.19,60.96 | IC2.6 13.97,29.72 14.22,29.97 16.38,29.97 v16.51,30.1 | LED1.C v32.26,73.53 | C1.1 v7.75,63.25
  Top 0.762: C10.2 v16.64,59.31 | IC1.1 11.96,61.13 C11.2 v12.19,60.96 | C19.2 52.13,60.9 v52.07,60.96 | C4.2 v51.94,45.21 | C3.2 v51.94,30.48 | C6.2 v52.07,15.11 | C12.2 v18.16,69.6
  other vias: 7.62,56.52 9.91,56.52 7.62,58.67
  pour Bottom: 0,0 0,74.93 74.93,74.93 74.93,0
ICDCLK  (via drill 0.33)
  Top 0.254: IC2.16 13.93,30.95 v10.41,27.43 | v7.24,24.13 7.24,21.84 5.71,20.32 4.57,20.32 JP11.5
  Bottom 0.254: v10.41,27.43 10.41,25.27 9.78,24.64 7.75,24.64 v7.24,24.13
ICDDAT
  Top 0.254: IC2.17 13.84,31.75 8.13,26.04 8.13,19.94 6.1,17.91 JP11.4
MCLR
  Top 0.254: C7.1 R10.1 12.38,4.16 TOUCH_RESET.P$2 TOUCH_RESET.P$3 | JP11.1 11.3,10.29 12.19,11.18 12.19,12.67 TOUCH_RESET.P$3 | TOUCH_RESET.P$3 12.23,15.02 R9.2
MCLR`  (via drill 0.33)
  Top 0.254: IC2.18 12.99,32.55 v9.65,29.21 | R9.1 12.19,18.8 8.89,22.1 v8.89,25.53
  Bottom 0.254: v8.89,25.53 8.89,28.45 v9.65,29.21
N$1
  Top 0.254: LED3.A R6.1
N$2  (via drill 0.33)
  Top 0.254: v3.81,56.39 6.08,58.66 BT_FTDI1.9
  Bottom 0.254: RST_JMPR1.2 R1.1 3.81,41.21 v3.81,56.39
N$3
  Top 0.254: LED6.A R13.1
N$4
  Top 0.254: R3.1 LED1.A
N$6
  Top 0.254: LED2.A R7.1
N$8
  Top 0.254: LED4.A R21.1
N$10
  Top 0.254: LED8.A R15.1
N$11
  Top 0.254: LED9.A R16.1
N$12
  Top 0.254: R2.1 2.78,53.98 LED5.A
STATUS_0  (via drill 0.33)
  Top 0.254: IC2.23 17.97,35.37 17.53,34.92 11.81,34.92 v11.56,35.18 | R13.2 6.67,49.78 7.11,49.78 9.65,47.24 v11.56,47.24
  Bottom 0.254: v11.56,47.24 12.95,45.85 12.95,38.73 11.56,37.47 v11.56,35.18
STATUS_1  (via drill 0.33)
  Top 0.254: IC2.30 12.37,39.19 v12.32,39.24 | v11.43,46.23 8.19,46.23 R6.2
  Bottom 0.254: v12.32,39.24 12.32,45.34 v11.43,46.23
STATUS_2  (via drill 0.33)
  Top 0.254: IC2.31 11.57,39.74 v11.56,39.75 | v11.56,45.34 6.92,45.34 R7.2
  Bottom 0.254: v11.56,39.75 v11.56,45.34
UART_RX  (via drill 0.33)
  Top 0.254: IC2.32 10.77,38.96 v10.79,38.99 | v10.79,48.01 10.79,51.17 10.86,51.24 | 10.86,51.24 LED9.C | v10.67,52.45 10.67,51.44 10.86,51.24 | BT_FTDI1.26 11.95,58.16 12.45,57.66 v12.45,55.37
  Bottom 0.254: v10.79,38.99 v10.79,48.01 | v12.45,55.37 12.45,54.23 v10.67,52.45
UART_TX  (via drill 0.33)
  Top 0.254: IC2.35 9.3,34.95 9.53,35.18 9.53,36.2 9.14,36.58 9.14,38.86 v10.03,39.75 | v10.03,48.77 10.03,53.21 10.92,54.1 LED8.C 11.81,54.22 11.81,57.4 11.56,57.66 BT_FTDI1.25
  Bottom 0.254: v10.03,39.75 v10.03,48.77
VBUS  (via drill 0.33)
  Top 0.254: R2.2 6.48,54.04 6.48,54.99 6.22,55.24 3.68,55.24 2.92,56.01 2.92,61.98 3.08,62.13 BT_USB_MICROB1.VBUS 4.06,62.24 v4.06,62.74 | BT_FTDI1.8 6.46,60.59 v6.35,60.71
  Top 0.762: v4.06,62.74 4.06,63.63 5.08,64.64 6.86,64.64 10.03,67.82 10.03,70.48 12.57,73.03 14.61,73.03 JP2.1
  Bottom 0.254: v6.35,60.71 6.1,60.71 v4.06,62.74